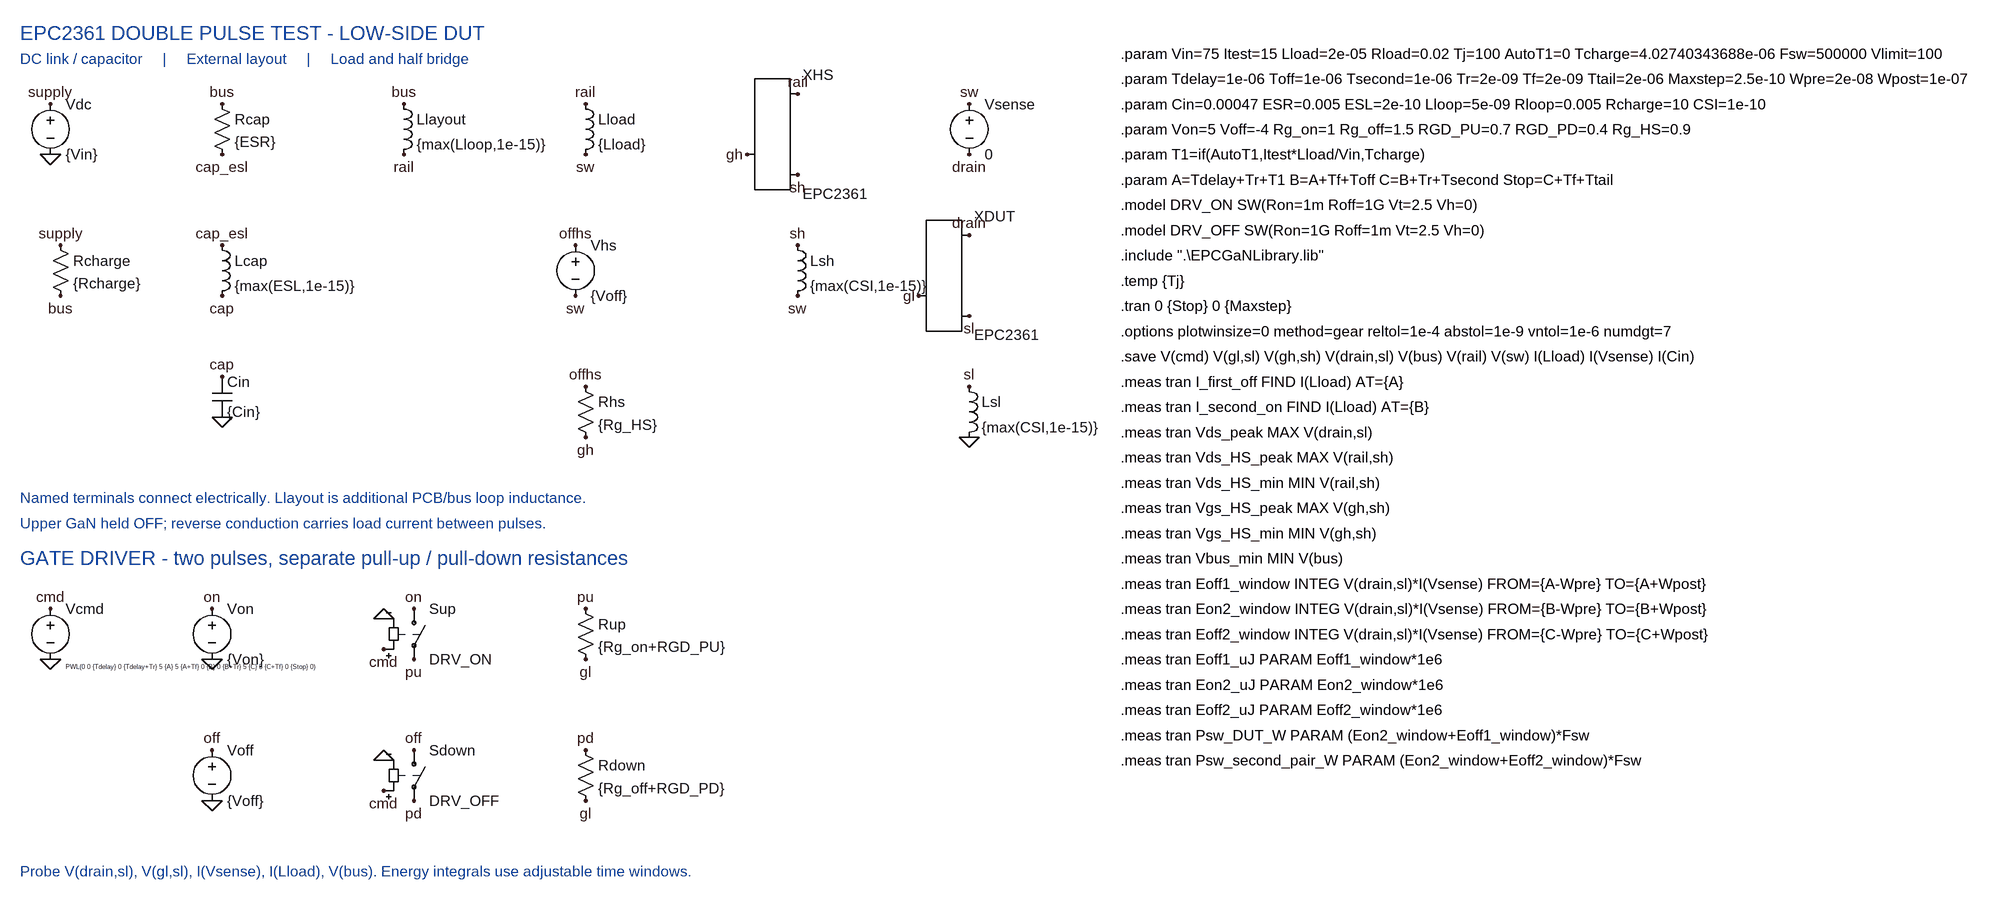
[diagram p0: schematic DPT.asc]
DPT.asc, the LTspice schematic file:
Version 4
SHEET 1 2700 1600
TEXT 48 0 Left 3 ;EPC2361 DOUBLE PULSE TEST - LOW-SIDE DUT
TEXT 48 40 Left 2 ;DC link / capacitor     |     External layout     |     Load and half bridge
TEXT 48 736 Left 2 ;Named terminals connect electrically. Llayout is additional PCB/bus loop inductance.
TEXT 48 776 Left 2 ;Upper GaN held OFF; reverse conduction carries load current between pulses.
TEXT 48 832 Left 3 ;GATE DRIVER - two pulses, separate pull-up / pull-down resistances
TEXT 48 1328 Left 2 ;Probe V(drain,sl), V(gl,sl), I(Vsense), I(Lload), V(bus). Energy integrals use adjustable time windows.
SYMBOL voltage 96 96 R0
SYMATTR InstName Vdc
SYMATTR Value {Vin}
FLAG 96 112 supply
FLAG 96 192 0
SYMBOL res 96 320 R0
SYMATTR InstName Rcharge
SYMATTR Value {Rcharge}
FLAG 112 336 supply
FLAG 112 416 bus
SYMBOL res 352 96 R0
SYMATTR InstName Rcap
SYMATTR Value {ESR}
FLAG 368 112 bus
FLAG 368 192 cap_esl
SYMBOL ind 352 320 R0
SYMATTR InstName Lcap
SYMATTR Value {max(ESL,1e-15)}
SYMATTR SpiceLine Rser=0
FLAG 368 336 cap_esl
FLAG 368 416 cap
SYMBOL cap 352 544 R0
SYMATTR InstName Cin
SYMATTR Value {Cin}
FLAG 368 544 cap
FLAG 368 608 0
SYMBOL ind 640 96 R0
SYMATTR InstName Llayout
SYMATTR Value {max(Lloop,1e-15)}
SYMATTR SpiceLine Rser={Rloop}
FLAG 656 112 bus
FLAG 656 192 rail
SYMBOL ind 928 96 R0
SYMATTR InstName Lload
SYMATTR Value {Lload}
SYMATTR SpiceLine Rser={Rload}
FLAG 944 112 rail
FLAG 944 192 sw
SYMBOL EPCGaN 1200 192 R0
SYMATTR InstName XHS
SYMATTR Value EPC2361
SYMATTR ModelFile .\EPCGaNLibrary.lib
FLAG 1200 192 gh
FLAG 1280 96 rail
FLAG 1280 224 sh
SYMBOL ind 1264 320 R0
SYMATTR InstName Lsh
SYMATTR Value {max(CSI,1e-15)}
SYMATTR SpiceLine Rser=0
FLAG 1280 336 sh
FLAG 1280 416 sw
SYMBOL voltage 1552 96 R0
SYMATTR InstName Vsense
SYMATTR Value 0
FLAG 1552 112 sw
FLAG 1552 192 drain
SYMBOL EPCGaN 1472 416 R0
SYMATTR InstName XDUT
SYMATTR Value EPC2361
SYMATTR ModelFile .\EPCGaNLibrary.lib
FLAG 1472 416 gl
FLAG 1552 320 drain
FLAG 1552 448 sl
SYMBOL ind 1536 544 R0
SYMATTR InstName Lsl
SYMATTR Value {max(CSI,1e-15)}
SYMATTR SpiceLine Rser=0
FLAG 1552 560 sl
FLAG 1552 640 0
SYMBOL voltage 928 320 R0
SYMATTR InstName Vhs
SYMATTR Value {Voff}
FLAG 928 336 offhs
FLAG 928 416 sw
SYMBOL res 928 544 R0
SYMATTR InstName Rhs
SYMATTR Value {Rg_HS}
FLAG 944 560 offhs
FLAG 944 640 gh
SYMBOL voltage 96 896 R0
WINDOW 3 24 108 Left 0
SYMATTR InstName Vcmd
SYMATTR Value PWL(0 0 {Tdelay} 0 {Tdelay+Tr} 5 {A} 5 {A+Tf} 0 {B} 0 {B+Tr} 5 {C} 5 {C+Tf} 0 {Stop} 0)
FLAG 96 912 cmd
FLAG 96 992 0
SYMBOL voltage 352 896 R0
SYMATTR InstName Von
SYMATTR Value {Von}
FLAG 352 912 on
FLAG 352 992 0
SYMBOL voltage 352 1120 R0
SYMATTR InstName Voff
SYMATTR Value {Voff}
FLAG 352 1136 off
FLAG 352 1216 0
SYMBOL sw 672 896 R0
SYMATTR InstName Sup
SYMATTR Value DRV_ON
FLAG 672 912 on
FLAG 672 992 pu
FLAG 624 976 cmd
FLAG 624 928 0
SYMBOL res 928 896 R0
SYMATTR InstName Rup
SYMATTR Value {Rg_on+RGD_PU}
FLAG 944 912 pu
FLAG 944 992 gl
SYMBOL sw 672 1120 R0
SYMATTR InstName Sdown
SYMATTR Value DRV_OFF
FLAG 672 1136 off
FLAG 672 1216 pd
FLAG 624 1200 cmd
FLAG 624 1152 0
SYMBOL res 928 1120 R0
SYMATTR InstName Rdown
SYMATTR Value {Rg_off+RGD_PD}
FLAG 944 1136 pd
FLAG 944 1216 gl
TEXT 1792 32 Left 2 !.param Vin=75 Itest=15 Lload=2e-05 Rload=0.02 Tj=100 AutoT1=0 Tcharge=4.02740343688e-06 Fsw=500000 Vlimit=100
TEXT 1792 72 Left 2 !.param Tdelay=1e-06 Toff=1e-06 Tsecond=1e-06 Tr=2e-09 Tf=2e-09 Ttail=2e-06 Maxstep=2.5e-10 Wpre=2e-08 Wpost=1e-07
TEXT 1792 112 Left 2 !.param Cin=0.00047 ESR=0.005 ESL=2e-10 Lloop=5e-09 Rloop=0.005 Rcharge=10 CSI=1e-10
TEXT 1792 152 Left 2 !.param Von=5 Voff=-4 Rg_on=1 Rg_off=1.5 RGD_PU=0.7 RGD_PD=0.4 Rg_HS=0.9
TEXT 1792 192 Left 2 !.param T1=if(AutoT1,Itest*Lload/Vin,Tcharge)
TEXT 1792 232 Left 2 !.param A=Tdelay+Tr+T1 B=A+Tf+Toff C=B+Tr+Tsecond Stop=C+Tf+Ttail
TEXT 1792 272 Left 2 !.model DRV_ON SW(Ron=1m Roff=1G Vt=2.5 Vh=0)
TEXT 1792 312 Left 2 !.model DRV_OFF SW(Ron=1G Roff=1m Vt=2.5 Vh=0)
TEXT 1792 352 Left 2 !.include ".\EPCGaNLibrary.lib"
TEXT 1792 392 Left 2 !.temp {Tj}
TEXT 1792 432 Left 2 !.tran 0 {Stop} 0 {Maxstep}
TEXT 1792 472 Left 2 !.options plotwinsize=0 method=gear reltol=1e-4 abstol=1e-9 vntol=1e-6 numdgt=7
TEXT 1792 512 Left 2 !.save V(cmd) V(gl,sl) V(gh,sh) V(drain,sl) V(bus) V(rail) V(sw) I(Lload) I(Vsense) I(Cin)
TEXT 1792 552 Left 2 !.meas tran I_first_off FIND I(Lload) AT={A}
TEXT 1792 592 Left 2 !.meas tran I_second_on FIND I(Lload) AT={B}
TEXT 1792 632 Left 2 !.meas tran Vds_peak MAX V(drain,sl)
TEXT 1792 672 Left 2 !.meas tran Vds_HS_peak MAX V(rail,sh)
TEXT 1792 712 Left 2 !.meas tran Vds_HS_min MIN V(rail,sh)
TEXT 1792 752 Left 2 !.meas tran Vgs_HS_peak MAX V(gh,sh)
TEXT 1792 792 Left 2 !.meas tran Vgs_HS_min MIN V(gh,sh)
TEXT 1792 832 Left 2 !.meas tran Vbus_min MIN V(bus)
TEXT 1792 872 Left 2 !.meas tran Eoff1_window INTEG V(drain,sl)*I(Vsense) FROM={A-Wpre} TO={A+Wpost}
TEXT 1792 912 Left 2 !.meas tran Eon2_window INTEG V(drain,sl)*I(Vsense) FROM={B-Wpre} TO={B+Wpost}
TEXT 1792 952 Left 2 !.meas tran Eoff2_window INTEG V(drain,sl)*I(Vsense) FROM={C-Wpre} TO={C+Wpost}
TEXT 1792 992 Left 2 !.meas tran Eoff1_uJ PARAM Eoff1_window*1e6
TEXT 1792 1032 Left 2 !.meas tran Eon2_uJ PARAM Eon2_window*1e6
TEXT 1792 1072 Left 2 !.meas tran Eoff2_uJ PARAM Eoff2_window*1e6
TEXT 1792 1112 Left 2 !.meas tran Psw_DUT_W PARAM (Eon2_window+Eoff1_window)*Fsw
TEXT 1792 1152 Left 2 !.meas tran Psw_second_pair_W PARAM (Eon2_window+Eoff2_window)*Fsw

The netlist it stands for:
* DPT.asc
Vdc supply 0 {Vin}
Rcharge supply bus {Rcharge}
Rcap bus cap_esl {ESR}
Lcap cap_esl cap {max(ESL,1e-15)} Rser=0
Cin cap 0 {Cin}
Llayout bus rail {max(Lloop,1e-15)} Rser={Rloop}
Lload rail sw {Lload} Rser={Rload}
XXHS gh rail sh EPC2361
Lsh sh sw {max(CSI,1e-15)} Rser=0
Vsense sw drain 0
XXDUT gl drain sl EPC2361
Lsl sl 0 {max(CSI,1e-15)} Rser=0
Vhs offhs sw {Voff}
Rhs offhs gh {Rg_HS}
Vcmd cmd 0 PWL(0 0 {Tdelay} 0 {Tdelay+Tr} 5 {A} 5 {A+Tf} 0 {B} 0 {B+Tr} 5 {C} 5 {C+Tf} 0 {Stop} 0)
Von on 0 {Von}
Voff off 0 {Voff}
Sup on pu cmd 0 DRV_ON
Rup pu gl {Rg_on+RGD_PU}
Sdown off pd cmd 0 DRV_OFF
Rdown pd gl {Rg_off+RGD_PD}
* EPC2361 DOUBLE PULSE TEST - LOW-SIDE DUT
* DC link / capacitor     |     External layout     |     Load and half bridge
* Named terminals connect electrically. Llayout is additional PCB/bus loop inductance.
* Upper GaN held OFF; reverse conduction carries load current between pulses.
* GATE DRIVER - two pulses, separate pull-up / pull-down resistances
* Probe V(drain,sl), V(gl,sl), I(Vsense), I(Lload), V(bus). Energy integrals use adjustable time windows.
.param Vin=75 Itest=15 Lload=2e-05 Rload=0.02 Tj=100 AutoT1=0 Tcharge=4.02740343688e-06 Fsw=500000 Vlimit=100
.param Tdelay=1e-06 Toff=1e-06 Tsecond=1e-06 Tr=2e-09 Tf=2e-09 Ttail=2e-06 Maxstep=2.5e-10 Wpre=2e-08 Wpost=1e-07
.param Cin=0.00047 ESR=0.005 ESL=2e-10 Lloop=5e-09 Rloop=0.005 Rcharge=10 CSI=1e-10
.param Von=5 Voff=-4 Rg_on=1 Rg_off=1.5 RGD_PU=0.7 RGD_PD=0.4 Rg_HS=0.9
.param T1=if(AutoT1,Itest*Lload/Vin,Tcharge)
.param A=Tdelay+Tr+T1 B=A+Tf+Toff C=B+Tr+Tsecond Stop=C+Tf+Ttail
.model DRV_ON SW(Ron=1m Roff=1G Vt=2.5 Vh=0)
.model DRV_OFF SW(Ron=1G Roff=1m Vt=2.5 Vh=0)
.include ".\EPCGaNLibrary.lib"
.temp {Tj}
.tran 0 {Stop} 0 {Maxstep}
.options plotwinsize=0 method=gear reltol=1e-4 abstol=1e-9 vntol=1e-6 numdgt=7
.save V(cmd) V(gl,sl) V(gh,sh) V(drain,sl) V(bus) V(rail) V(sw) I(Lload) I(Vsense) I(Cin)
.meas tran I_first_off FIND I(Lload) AT={A}
.meas tran I_second_on FIND I(Lload) AT={B}
.meas tran Vds_peak MAX V(drain,sl)
.meas tran Vds_HS_peak MAX V(rail,sh)
.meas tran Vds_HS_min MIN V(rail,sh)
.meas tran Vgs_HS_peak MAX V(gh,sh)
.meas tran Vgs_HS_min MIN V(gh,sh)
.meas tran Vbus_min MIN V(bus)
.meas tran Eoff1_window INTEG V(drain,sl)*I(Vsense) FROM={A-Wpre} TO={A+Wpost}
.meas tran Eon2_window INTEG V(drain,sl)*I(Vsense) FROM={B-Wpre} TO={B+Wpost}
.meas tran Eoff2_window INTEG V(drain,sl)*I(Vsense) FROM={C-Wpre} TO={C+Wpost}
.meas tran Eoff1_uJ PARAM Eoff1_window*1e6
.meas tran Eon2_uJ PARAM Eon2_window*1e6
.meas tran Eoff2_uJ PARAM Eoff2_window*1e6
.meas tran Psw_DUT_W PARAM (Eon2_window+Eoff1_window)*Fsw
.meas tran Psw_second_pair_W PARAM (Eon2_window+Eoff2_window)*Fsw
.lib .\EPCGaNLibrary.lib
.backanno
.end